# Altium schematic sheet display.SchDoc
size A3; DocumentNumber: 2; SheetNumber: 2; SheetTotal: 6; PageSetup: Record=PageOptions|CenterHorizontal=True|CenterVertical=True|PrintScale=0.97|XCorrection=1.00|YCorrection=1.00|PrintKind=1|BorderSize=5000000|LeftOffset=0|BottomOffset=0|Orientation=2|PaperLength=2970|PaperWidth=2100|Scale=100|PaperSource=7|PrintQuality=600|MediaType=1|DitherType=10|PaperKind=A4|PrintScaleMode=1
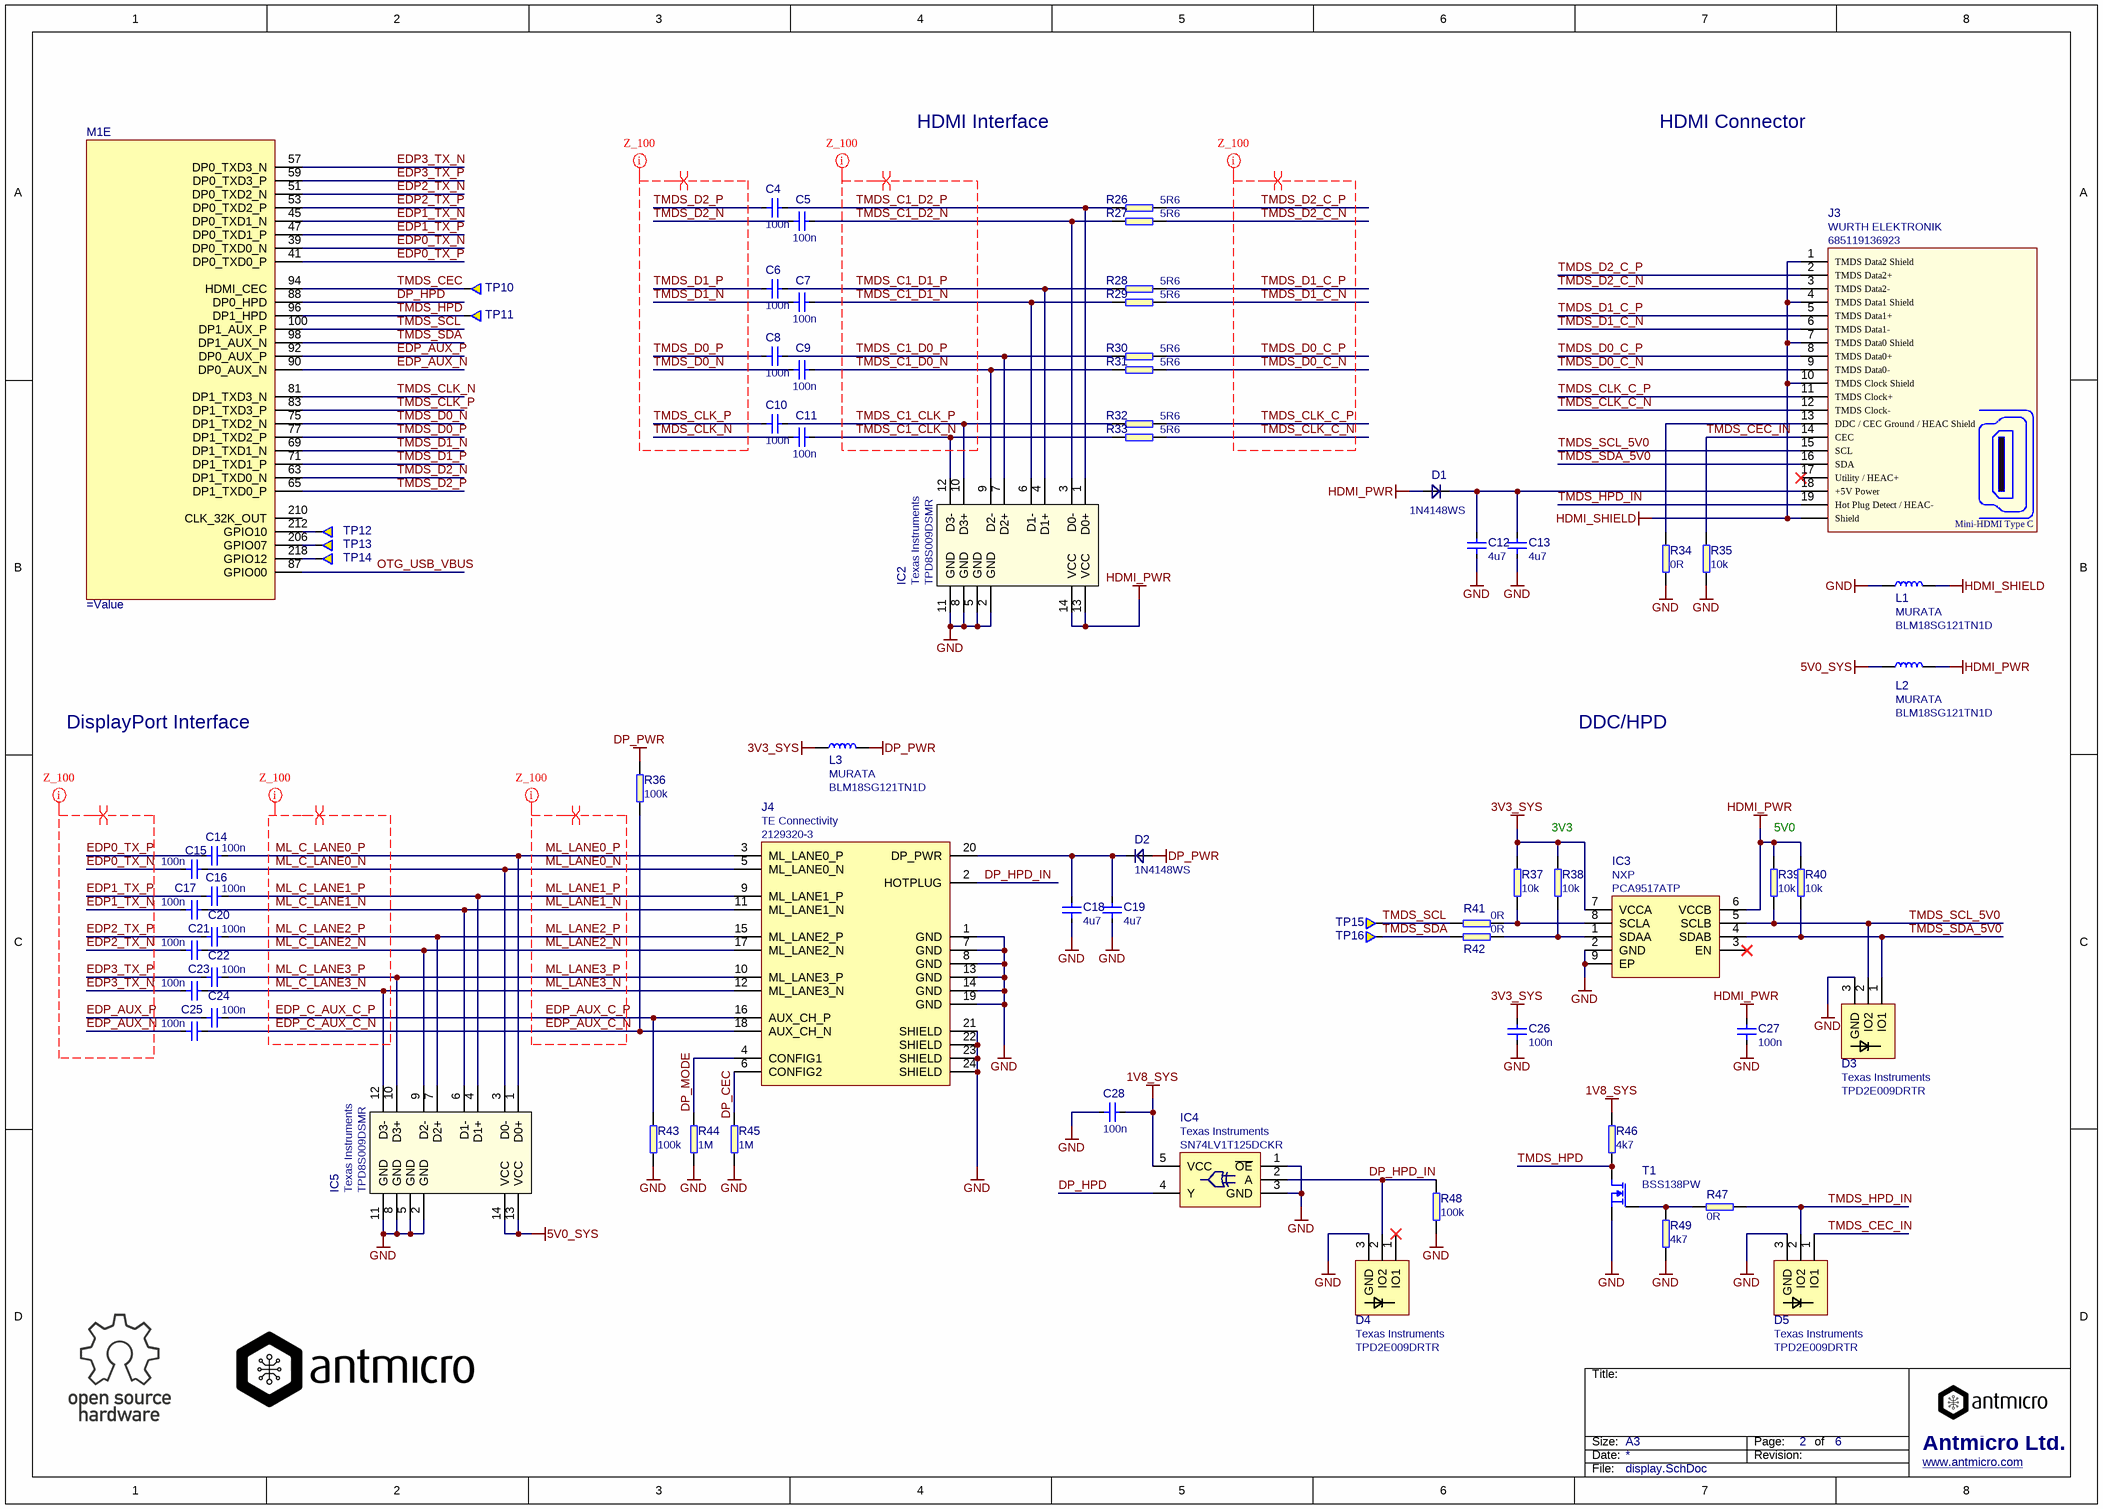
[diagram p0: display.SchDoc]

## Parts
C4  100n  [0402]
C5  100n  [0402]
C6  100n  [0402]
C7  100n  [0402]
C8  100n  [0402]
C9  100n  [0402]
C10  100n  [0402]
C11  100n  [0402]
C12  4u7  [0402]
C13  4u7  [0402]
C14  100n  [0402]
C15  100n  [0402]
C16  100n  [0402]
C17  100n  [0402]
C18  4u7  [0402]
C19  4u7  [0402]
C20  100n  [0402]
C21  100n  [0402]
C22  100n  [0402]
C23  100n  [0402]
C24  100n  [0402]
C25  100n  [0402]
C26  100n  [0603]
C27  100n  [0603]
C28  100n  [0603]
D1  1N4148WS  [SOD-323]
D2  1N4148WS  [SOD-323]
D3  TPD2E009DRTR  Manufacturer: Texas Instruments  [SOT-3]
D4  TPD2E009DRTR  Manufacturer: Texas Instruments  [SOT-3]
D5  TPD2E009DRTR  Manufacturer: Texas Instruments  [SOT-3]
IC2  Manufacturer: Texas Instruments  PartSymbol: TPD8S009DSMR  [SON-15]  (hidden comment: TPD8S009)
IC3  PCA9517ATP  Manufacturer: NXP  [PCA9517ATP]
IC4  SN74LV1T125DCKR  Manufacturer: Texas Instruments  [SC70-5]
IC5  Manufacturer: Texas Instruments  PartSymbol: TPD8S009DSMR  [SON-15]  (hidden comment: TPD8S009)
J3  685119136923  Manufacturer: WURTH ELEKTRONIK  [WE_685119136923]
J4  2129320-3  Manufacturer: TE Connectivity  [2129320-3]
L1  BLM18SG121TN1D  Manufacturer: MURATA  [0603]
L2  BLM18SG121TN1D  Manufacturer: MURATA  [0603]
L3  BLM18SG121TN1D  Manufacturer: MURATA  [0603]
M1  (no value)  [jetson-nano-connector]  (part E of 7)
R26  5R6  [0402]
R27  5R6  [0402]
R28  5R6  [0402]
R29  5R6  [0402]
R30  5R6  [0402]
R31  5R6  [0402]
R32  5R6  [0402]
R33  5R6  [0402]
R34  0R  [0402]
R35  10k  [0402]
R36  100k  [0603]
R37  10k  [0603]
R38  10k  [0603]
R39  10k  [0603]
R40  10k  [0603]
R41  0R  [0402]
R42  0R  [0402]
R43  100k  [0603]
R44  1M  [0603]
R45  1M  [0603]
R46  4k7  [0603]
R47  0R  [0402]
R48  100k  [0603]
R49  4k7  [0603]
T1  BSS138PW  [SC70-3]
TP10  Testpad  [TP-R-1.5]  (value not drawn)  (no BOM)
TP11  Testpad  [TP-R-1.5]  (value not drawn)  (no BOM)
TP12  Testpad  [TP-R-1.5]  (value not drawn)  (no BOM)
TP13  Testpad  [TP-R-1.5]  (value not drawn)  (no BOM)
TP14  Testpad  [TP-R-1.5]  (value not drawn)  (no BOM)
TP15  Testpad  [TP-R-1.5]  (value not drawn)  (no BOM)
TP16  Testpad  [TP-R-1.5]  (value not drawn)  (no BOM)

## Nets
1V8_SYS: C28.2 IC4.5(VCC) R46.2
3V3_SYS: C26.2 IC3.7(VCCA) L3.1 R37.2 R38.2
5V0_SYS: IC5.13(VCC) IC5.14(VCC) L2.1
DP_PWR: D2.A L3.2 R36.1
GND: C12.1 C13.1 C18.1 C19.1 C26.1 C27.1 C28.1 D3.3(GND) D4.3(GND) D5.3(GND) IC2.2(GND) IC2.5(GND) IC2.8(GND) IC2.11(GND) IC3.2(GND) IC3.9(EP) IC4.1(~{OE}) IC4.3(GND) IC5.2(GND) IC5.5(GND) IC5.8(GND) IC5.11(GND) J4.1(GND) J4.7(GND) J4.8(GND) J4.13(GND) J4.14(GND) J4.19(GND) J4.21(SHIELD) J4.22(SHIELD) J4.23(SHIELD) J4.24(SHIELD) L1.1 R34.1 R35.1 R43.1 R44.1 R45.1 R48.2 R49.1 T1.2(S)
HDMI_PWR: C27.2 D1.A IC2.13(VCC) IC2.14(VCC) IC3.6(VCCB) L2.2 R39.2 R40.2
HDMI_SHIELD: J3.1(TMDS_Data2_Shield) J3.4(TMDS_Data1_Shield) J3.7(TMDS_Data0_Shield) J3.10(TMDS_Clock_Shield) J3.Shell(Shield) L1.2
DP_HPD: IC4.4(Y) M1.88(DP0_HPD)
DP_HPD_IN: D4.2(IO2) IC4.2(A) J4.2(HOTPLUG) R48.1
DP_MODE: J4.4(CONFIG1) R44.2
EDP0_TX_N: C15.1 M1.39(DP0_TXD0_N)
EDP0_TX_P: C14.1 M1.41(DP0_TXD0_P)
EDP1_TX_N: C17.1 M1.45(DP0_TXD1_N)
EDP1_TX_P: C16.1 M1.47(DP0_TXD1_P)
EDP2_TX_N: C21.1 M1.51(DP0_TXD2_N)
EDP2_TX_P: C20.1 M1.53(DP0_TXD2_P)
EDP3_TX_N: C22.1 M1.57(DP0_TXD3_N)
EDP3_TX_P: C23.1 M1.59(DP0_TXD3_P)
EDP_AUX_C_N: C25.2 J4.18(AUX_CH_N) R36.2  [also labelled EDP_C_AUX_C_N]
EDP_AUX_C_P: C24.2 J4.16(AUX_CH_P) R43.2  [also labelled EDP_C_AUX_C_P]
EDP_AUX_N: C25.1 M1.90(DP0_AUX_N)
EDP_AUX_P: C24.1 M1.92(DP0_AUX_P)
ML_C_LANE0_N: C15.2 IC5.3(D0-) J4.5(ML_LANE0_N)  [also labelled ML_LANE0_N]
ML_C_LANE0_P: C14.2 IC5.1(D0+) J4.3(ML_LANE0_P)  [also labelled ML_LANE0_P]
ML_C_LANE1_N: C17.2 IC5.6(D1-) J4.11(ML_LANE1_N)  [also labelled ML_LANE1_N]
ML_C_LANE1_P: C16.2 IC5.4(D1+) J4.9(ML_LANE1_P)  [also labelled ML_LANE1_P]
ML_C_LANE2_N: C21.2 IC5.9(D2-) J4.17(ML_LANE2_N)  [also labelled ML_LANE2_N]
ML_C_LANE2_P: C20.2 IC5.7(D2+) J4.15(ML_LANE2_P)  [also labelled ML_LANE2_P]
ML_C_LANE3_N: C22.2 IC5.12(D3-) J4.12(ML_LANE3_N)  [also labelled ML_LANE3_N]
ML_C_LANE3_P: C23.2 IC5.10(D3+) J4.10(ML_LANE3_P)  [also labelled ML_LANE3_P]
OTG_USB_VBUS: M1.87(GPIO00)
TMDS_C1_CLK_N: C11.2 IC2.12(D3-) R33.1
TMDS_C1_CLK_P: C10.2 IC2.10(D3+) R32.1
TMDS_C1_D0_N: C9.2 IC2.9(D2-) R31.1
TMDS_C1_D0_P: C8.2 IC2.7(D2+) R30.1
TMDS_C1_D1_N: C7.2 IC2.6(D1-) R29.1
TMDS_C1_D1_P: C6.2 IC2.4(D1+) R28.1
TMDS_C1_D2_N: C5.2 IC2.3(D0-) R27.1
TMDS_C1_D2_P: C4.2 IC2.1(D0+) R26.1
TMDS_CEC: M1.94(HDMI_CEC) TP10.1
TMDS_CEC_IN: D5.1(IO1) J3.14(CEC) R35.2
TMDS_CLK_C_N: J3.12(TMDS_Clock-) R33.2
TMDS_CLK_C_P: J3.11(TMDS_Clock+) R32.2
TMDS_CLK_N: C11.1 M1.81(DP1_TXD3_N)
TMDS_CLK_P: C10.1 M1.83(DP1_TXD3_P)
TMDS_D0_C_N: J3.9(TMDS_Data0-) R31.2
TMDS_D0_C_P: J3.8(TMDS_Data0+) R30.2
TMDS_D0_N: C9.1 M1.75(DP1_TXD2_N)
TMDS_D0_P: C8.1 M1.77(DP1_TXD2_P)
TMDS_D1_C_N: J3.6(TMDS_Data1-) R29.2
TMDS_D1_C_P: J3.5(TMDS_Data1+) R28.2
TMDS_D1_N: C7.1 M1.69(DP1_TXD1_N)
TMDS_D1_P: C6.1 M1.71(DP1_TXD1_P)
TMDS_D2_C_N: J3.3(TMDS_Data2-) R27.2
TMDS_D2_C_P: J3.2(TMDS_Data2+) R26.2
TMDS_D2_N: C5.1 M1.63(DP1_TXD0_N)
TMDS_D2_P: C4.1 M1.65(DP1_TXD0_P)
TMDS_HPD: M1.96(DP1_HPD) R46.1 T1.3(D) TP11.1
TMDS_HPD_IN: D5.2(IO2) J3.19(Hot_Plug_Detect_/_HEAC-) R47.1
TMDS_SCL: M1.100(DP1_AUX_P) R41.2 TP15.1
TMDS_SCL_5V0: D3.2(IO2) IC3.5(SCLB) J3.15(SCL) R39.1
TMDS_SDA: M1.98(DP1_AUX_N) R42.2 TP16.1
TMDS_SDA_5V0: D3.1(IO1) IC3.4(SDAB) J3.16(SDA) R40.1
NetC12_2: C12.2 C13.2 D1.C J3.18(+5V_Power)
NetC18_2: C18.2 C19.2 D2.C J4.20(DP_PWR)
NetIC3_1: IC3.1(SDAA) R38.1 R42.1
NetIC3_8: IC3.8(SCLA) R37.1 R41.1
NetJ3_13: J3.13(DDC_/_CEC_Ground_/_HEAC_Shield) R34.2
NetJ4_6: J4.6(CONFIG2) R45.2
NetM1_206: M1.206(GPIO07) TP13.1
NetM1_212: M1.212(GPIO10) TP12.1
NetM1_218: M1.218(GPIO12) TP14.1
NetR47_2: R47.2 R49.2 T1.1(G)

Not connected (* = marked no-connect by the designer): D4 1(IO1)*; IC3 3(EN)*; J3 17(Utility_/_HEAC+)*; M1 210(CLK_32K_OUT)

## Layout directives
differential pair: EDP0_TX_N, EDP0_TX_P, EDP1_TX_N, EDP1_TX_P, EDP2_TX_N, EDP2_TX_P, EDP3_TX_N, EDP3_TX_P, EDP_AUX_C_N, EDP_AUX_C_P, EDP_AUX_N, EDP_AUX_P, EDP_C_AUX_C_N, EDP_C_AUX_C_P, ML_C_LANE0_N, ML_C_LANE0_P, ML_C_LANE1_N, ML_C_LANE1_P, ML_C_LANE2_N, ML_C_LANE2_P, ML_C_LANE3_N, ML_C_LANE3_P, ML_LANE0_N, ML_LANE0_P, ML_LANE1_N, ML_LANE1_P, ML_LANE2_N, ML_LANE2_P, ML_LANE3_N, ML_LANE3_P, TMDS_C1_CLK_N, TMDS_C1_CLK_P, TMDS_C1_D0_N, TMDS_C1_D0_P, TMDS_C1_D1_N, TMDS_C1_D1_P, TMDS_C1_D2_N, TMDS_C1_D2_P, TMDS_CLK_C_N, TMDS_CLK_C_P, TMDS_CLK_N, TMDS_CLK_P, TMDS_D0_C_N, TMDS_D0_C_P, TMDS_D0_N, TMDS_D0_P, TMDS_D1_C_N, TMDS_D1_C_P, TMDS_D1_N, TMDS_D1_P, TMDS_D2_C_N, TMDS_D2_C_P, TMDS_D2_N, TMDS_D2_P
net class Z_100: EDP0_TX_N, EDP0_TX_P, EDP1_TX_N, EDP1_TX_P, EDP2_TX_N, EDP2_TX_P, EDP3_TX_N, EDP3_TX_P, EDP_AUX_C_N, EDP_AUX_C_P, EDP_AUX_N, EDP_AUX_P, EDP_C_AUX_C_N, EDP_C_AUX_C_P, ML_C_LANE0_N, ML_C_LANE0_P, ML_C_LANE1_N, ML_C_LANE1_P, ML_C_LANE2_N, ML_C_LANE2_P, ML_C_LANE3_N, ML_C_LANE3_P, ML_LANE0_N, ML_LANE0_P, ML_LANE1_N, ML_LANE1_P, ML_LANE2_N, ML_LANE2_P, ML_LANE3_N, ML_LANE3_P, TMDS_C1_CLK_N, TMDS_C1_CLK_P, TMDS_C1_D0_N, TMDS_C1_D0_P, TMDS_C1_D1_N, TMDS_C1_D1_P, TMDS_C1_D2_N, TMDS_C1_D2_P, TMDS_CLK_C_N, TMDS_CLK_C_P, TMDS_CLK_N, TMDS_CLK_P, TMDS_D0_C_N, TMDS_D0_C_P, TMDS_D0_N, TMDS_D0_P, TMDS_D1_C_N, TMDS_D1_C_P, TMDS_D1_N, TMDS_D1_P, TMDS_D2_C_N, TMDS_D2_C_P, TMDS_D2_N, TMDS_D2_P

## Notes on the sheet
- HDMI Interface
- HDMI Connector
- 1V8
- DisplayPort Interface
- DDC/HPD
- 3V3
- 5V0
- Labels drawn without touching a wire or pin: DP_CEC
- Title:
- Size:
- Date:
- A3
- Revision:
- Page:
- of
- Antmicro Ltd.
- File:
- www.antmicro.com
- (in symbol WE_685119136923) Mini-HDMI Type C

## Library data of the parts
C4-C11 C14-C17 C20-C25 = C_100n_0402: MLCC SMT Capacitor 100n 0402; Manufacturer: TDK; PartSymbol: C1005X5R0J104K050BA; Value: 100n; PartNumber: C_100n_0402
C12 C13 C18 C19 = C_4u7_0402: MLCC SMT Capacitor 4.7uF 0402; Manufacturer: MURATA; PartSymbol: GRM155R60G475ME; PartNumber: C_4u7_0402; Value: 4u7
C26-C28 = C_100n_0603: MLCC SMT Capacitor 100nF 0603; Manufacturer: AVX; PartSymbol: 0603YC104KAZ2A; Value: 100n; PartNumber: C_100n_0603
D1 D2 = diode: Diode small signal; Manufacturer: ON SEMICONDUCTOR; Value: 1N4148WS; PartNumber: 1N4148WS; PartSymbol: 1N4148WS
D3-D5 = TPD2E009: ESD Suppressors 2-CH; Value: TPD2E009DRTR; PartNumber: TPD2E009DRTR; PartSymbol: TPD2E009DRTR
IC2 IC5 = TPD8S009: 8-Channel ESD Protection for DisplayPort and HDMI; Value: TPD8S009; PartNumber: TPD8S009
IC3 = PCA9517ATP: I2C BUS REPEATER W/ LEVEL TRANS, HWSON-8; Value: PCA9517ATP; PartNumber: PCA9517ATP; PartSymbol: PCA9517ATP
IC4 = SN74LV1T125: Buffer, 74LV1T125, 1.6 V to 5.5 V, SOT-23-5; PartNumber: SN74LV1T125DCKR; Value: SN74LV1T125DCKR; PartSymbol: SN74LV1T125DCKR
J3 = WE_685119136923: CONN HDMI FEMALE R/A 19POS 2.6MM; PartNumber: WE_685119136923; Value: 685119136923; PartSymbol: WE_685119136923
J4 = miniDP: Mini Displayport Reverse Offset; PartNumber: 2129320-3; Value: 2129320-3; PartSymbol: 2129320-3
L1-L3 = BLM18SG121TN1D: FERRITE BEAD, 0.025OHM, 3A, 0603; Value: BLM18SG121TN1D; PartNumber: BLM18SG121TN1D; PartSymbol: BLM18SG121TN1D
M1 = jetson-nano-new-release: PartNumber: jetson-nano-new-release
R26-R33 = R_5R6_0402: RES, 5R6, 0402; Manufacturer: Panasonic; PartSymbol: ERJ2GEJ5R6X; PartNumber: R_5R6_0402; Value: 5R6
R34 R41 R42 R47 = R_0R_0402: RES, 0R, 0402; Manufacturer: Panasonic; PartSymbol: ERJ2GE0R00X; PartNumber: R_0R_0402; Value: 0R
R35 = R_10k_0402: RES, 10k, 0402; Manufacturer: MULTICOMP; PartSymbol: MCMR04X1002FTL; Value: 10k; PartNumber: R_10k_0402
R36 R43 R48 = R_100k_0603: RES, 100k, 0603; Manufacturer: BOURNS; PartSymbol: CR0603-FX-1003HLF; Value: 100k; PartNumber: R_100k_0603
R37-R40 = R_10k_0603: RES, 10k, 0603; Manufacturer: BOURNS; PartSymbol: CR0603-JW-103ELF; Value: 10k; PartNumber: R_10k_0603
R44 R45 = R_1M_0603: RES, 1M, 0603; Manufacturer: BOURNS; PartSymbol: CR0603-JW-105GLF; Value: 1M; PartNumber: R_1M_0603
R46 R49 = R_4k7_0603: RES, 4k7, 0603; Manufacturer: BOURNS; PartSymbol: CR0603-FX-4701ELF; Value: 4k7; PartNumber: R_4k7_0603
T1 = NMOS: MOSFET, N CH, 60V, 0.2A; Manufacturer: NXP; Value: BSS138PW; PartNumber: BSS138PW; PartSymbol: BSS138PW
TP10-TP16 = Testpad: Testpad, round, 1.5mm; PartNumber: TP-R-1.5